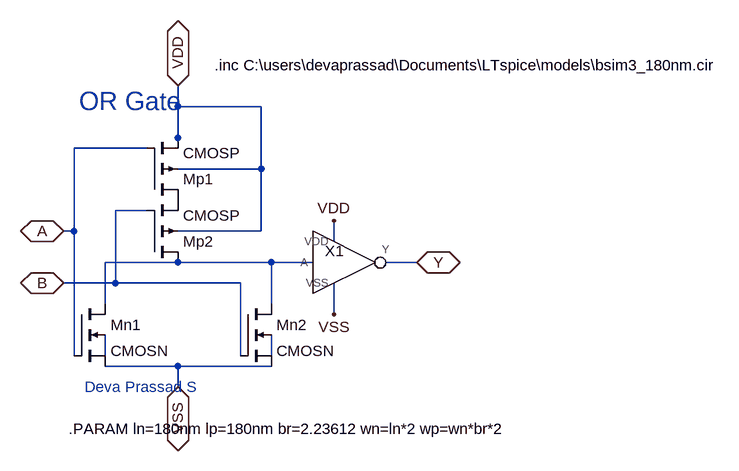
[diagram p0: schematic or1x.asc]
or1x.asc, the LTspice schematic file:
Version 4.1
SHEET 1 1188 680
WIRE 224 -64 224 -96
WIRE 352 -64 224 -64
WIRE 224 -16 224 -64
WIRE 176 0 64 0
WIRE 224 0 224 -16
WIRE 352 32 352 -64
WIRE 352 32 224 32
WIRE 176 96 128 96
WIRE 64 128 64 0
WIRE 64 128 48 128
WIRE 352 128 352 32
WIRE 352 128 224 128
WIRE 464 144 464 112
WIRE 224 176 112 176
WIRE 368 176 224 176
WIRE 432 176 368 176
WIRE 592 176 544 176
WIRE 128 208 128 96
WIRE 128 208 48 208
WIRE 320 208 128 208
WIRE 112 240 112 176
WIRE 368 240 368 176
WIRE 464 256 464 208
WIRE 64 320 64 128
WIRE 112 320 112 288
WIRE 320 320 320 208
WIRE 368 320 368 288
WIRE 224 336 112 336
WIRE 368 336 224 336
WIRE 224 368 224 336
FLAG 592 176 Y
IOPIN 592 176 BiDir
FLAG 48 128 A
IOPIN 48 128 BiDir
FLAG 48 208 B
IOPIN 48 208 BiDir
FLAG 224 -96 VDD
IOPIN 224 -96 BiDir
FLAG 224 368 VSS
IOPIN 224 368 BiDir
FLAG 464 112 VDD
FLAG 464 256 VSS
SYMBOL nmos4 64 240 R0
SYMATTR InstName Mn1
SYMATTR Value2 l={ln} w={wn} ad={ln*wn} as={ln*wn} pd={2*ln+wn} ps={2*ln+wn}
SYMATTR Value CMOSN
SYMBOL nmos4 320 240 R0
SYMATTR InstName Mn2
SYMATTR Value2 l={ln} w={wn} ad={ln*wn} as={ln*wn} pd={2*ln+wn} ps={2*ln+wn}
SYMATTR Value CMOSN
SYMBOL pmos4 176 80 M180
SYMATTR InstName Mp1
SYMATTR Value2 l={lp} w={wp} ad={lp*wp} as={lp*wp} pd={2*lp+wp} ps={2*lp+wp}
SYMATTR Value CMOSP
SYMBOL pmos4 176 176 M180
SYMATTR InstName Mp2
SYMATTR Value2 l={lp} w={wp} ad={lp*wp} as={lp*wp} pd={2*lp+wp} ps={2*lp+wp}
SYMATTR Value CMOSP
SYMBOL diglib\\inv1x\\inv1x 496 176 R0
SYMATTR InstName X1
TEXT 80 368 Left 2 ;Deva Prassad S
TEXT 72 -72 Left 4 ;OR Gate
TEXT 280 -128 Left 2 !.inc C:\\users\\devaprassad\\Documents\\LTspice\\models\\bsim3_180nm.cir
TEXT 56 432 Left 2 !.PARAM ln=180nm lp=180nm br=2.23612 wn=ln*2 wp=wn*br*2

The netlist it stands for:
* or1x.asc
Mn1 N001 A VSS N002 CMOSN l={ln} w={wn} ad={ln*wn} as={ln*wn} pd={2*ln+wn} ps={2*ln+wn}
Mn2 N001 B VSS N003 CMOSN l={ln} w={wn} ad={ln*wn} as={ln*wn} pd={2*ln+wn} ps={2*ln+wn}
Mp1 P001 A VDD VDD CMOSP l={lp} w={wp} ad={lp*wp} as={lp*wp} pd={2*lp+wp} ps={2*lp+wp}
Mp2 N001 B P001 VDD CMOSP l={lp} w={wp} ad={lp*wp} as={lp*wp} pd={2*lp+wp} ps={2*lp+wp}
X§X1 N001 VDD VSS Y inv1x  ; pins A VDD VSS Y
.model NMOS NMOS
.model PMOS PMOS
.lib standard.mos
* Deva Prassad S
* OR Gate
.inc C:\users\devaprassad\Documents\LTspice\models\bsim3_180nm.cir
.PARAM ln=180nm lp=180nm br=2.23612 wn=ln*2 wp=wn*br*2
.backanno
.end